# Altium schematic sheet Logic.SchDoc: Kookwekker
size A4; Author: Fabian Eppens; DrawnBy: Fabian Eppens; Revision: 1.0; SheetNumber: 2; SheetTotal: 3
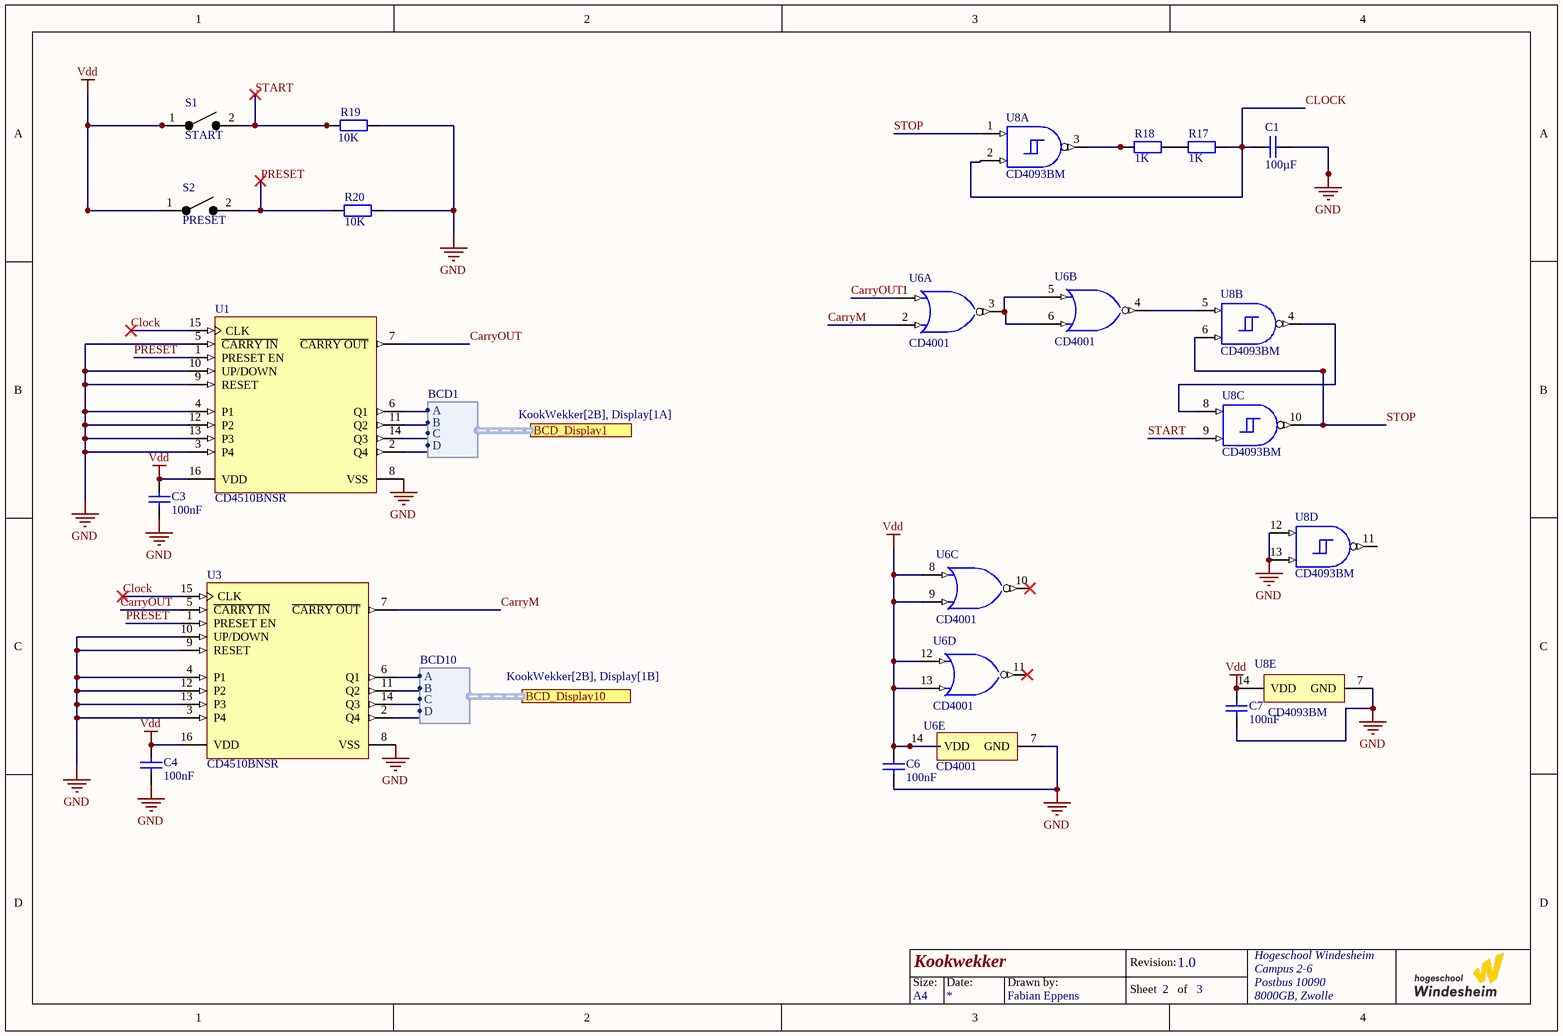
[diagram p0: Logic.SchDoc]

## Parts
C1  100µF  [C1206]
C3  100nF  [C1206]
C4  100nF  [C1206]
C6  100nF  [C1206]
C7  100nF  [C1206]
R17  1K  [R1206]
R18  1K  [R1206]
R19  10K  [R1206]
R20  10K  [R1206]
S1  START  [1478731]
S2  PRESET  [1478731]
U1  CD4510BNSR  [NS0016A_N]
U3  CD4510BNSR  [NS0016A_N]
U6  CD4001  [D0014A_N]  (parts A,B,C,D,E of 5)
U8  CD4093BM  [D0014A_N]  (parts A,B,C,D,E of 5)

## Ports
BCD_Display1 (harness BCD1, see KookWekker[2B], Display[1A]), BCD_Display10 (harness BCD10, see KookWekker[2B], Display[1B])

## Harnesses
BCD1: A, B, C, D
BCD10: A, B, C, D

## Nets
GND: C1.2 C3.2 C4.2 C6.1 C7.1 R19.2 R20.2 U1.3(P4) U1.4(P1) U1.5(~{CARRY_IN}) U1.8(VSS) U1.9(RESET) U1.10(UP/DOWN) U1.12(P2) U1.13(P3) U3.3(P4) U3.4(P1) U3.8(VSS) U3.9(RESET) U3.10(UP/DOWN) U3.12(P2) U3.13(P3) U6.7(GND) U8.7(GND) U8.12(G) U8.13(H)
Vdd: C3.1 C4.1 C6.2 C7.2 S1.1 S2.1 U1.16(VDD) U3.16(VDD) U6.8(E) U6.9(F) U6.12(G) U6.13(H) U6.14(VDD) U8.14(VDD)
CarryM: U3.7(~{CARRY_OUT}) U6.2(B)
CarryOUT: U1.7(~{CARRY_OUT}) U3.5(~{CARRY_IN}) U6.1(A)
Clock: C1.1 R17.2 U1.15(CLK) U3.15(CLK) U8.2(B)
PRESET: R20.1 S2.2 U1.1(PRESET_EN) U3.1(PRESET_EN)
START: R19.1 S1.2 U8.9(F)
STOP: U8.1(A) U8.6(D) U8.10(L)
NetR17_1: R17.1 R18.2
NetR18_1: R18.1 U8.3(J)
NetU1_2: U1.2(Q4) ; port BCD_Display1.D
NetU1_6: U1.6(Q1) ; port BCD_Display1.A
NetU1_11: U1.11(Q2) ; port BCD_Display1.B
NetU1_14: U1.14(Q3) ; port BCD_Display1.C
NetU3_2: U3.2(Q4) ; port BCD_Display10.D
NetU3_6: U3.6(Q1) ; port BCD_Display10.A
NetU3_11: U3.11(Q2) ; port BCD_Display10.B
NetU3_14: U3.14(Q3) ; port BCD_Display10.C
NetU6_3: U6.3(J) U6.5(C) U6.6(D)
NetU6_4: U6.4(K) U8.5(C)
NetU8_4: U8.4(K) U8.8(E)

Not connected (* = marked no-connect by the designer): U6 10(L)* 11(M)*; U8 11(M)

## Notes on the sheet
- Size:
- Date:
- Drawn by:
- Revision:
- Hogeschool Windesheim
- Campus 2-6
- Postbus 10090
- A4
- Sheet
- of
- 8000GB, Zwolle

## Library data of the parts
C1 C3 C4 C6 C7 = Capacitor_1206: SMD Capacitor 1206; Published: 03-11-2016; LatestRevisionDate: 03-11-2016; LatestRevisionNote: Creation; PackageReference: C1206; Publisher: Windesheim; PackageDescription: Chip Capacitor, Body 3.2x1.6mm, Height 1.7mm, IPC Medium Density
  C1: Value: 100µF
  C3 C4 C6 C7: Value: 100nF
R17-R20 = Resistor_1206: SMD Resistor 1206; Published: 03-11-2016; LatestRevisionDate: 03-11-2016; LatestRevisionNote: Creation; PackageReference: R1206; Publisher: Windesheim; PackageDescription: Chip Resistor, Body 3.2x1.6mm, IPC Medium Density
  R17 R18: Value: 1K
  R19 R20: Value: 10K
S1 S2 = Switch: Manufacturer_Name: TE Connectivity; Manufacturer_Part_Number: 147873-1; Datasheet Link: https://componentsearchengine.com/Datasheets/1/147873-1.pdf; Height: 5mm; Mouser Part Number: 506-147873-1; Mouser Price/Stock: https://www.mouser.com/Search/Refine.aspx?Keyword=506-147873-1
U1 U3 = CD4510BNSR: CMOS Presettable BCD Up/Down Counter, NS0016A, LARGE T&R; Manufacturer: Texas Instruments; Bits(#): 4; VCC(Min)(V): 3; Voltage(Nom)(V): 5,10,15; Schmitt Trigger: No; Output Drive (IOL/IOH)(Max)(mA): 1.5/-1.5; Rating: Catalog; Inputs: 1; VCC(Max)(V): 18; Technology Family: CD4000; F @ Nom Voltage(Max)(Mhz): 8; ICC @ Nom Voltage(Max)(mA): 0.03; tpd @ Nom Voltage(Max)(ns): 200; PackageReference: NS0016A; DatasheetVersion: SCHS071B; Generic Part Number: CD4510B; Operating Temperature Range(C): -55 to 125; Output Type: CMOS; Input Type: CMOS; Type: Other; Function: Counter
U6 = CD4001: CMOS Quad 2-Input NOR Schmitt Triggers, D0014A, TUBE; Generic Part Number: CD4093B; Manufacturer: Texas Instruments; Output Drive (IOL/IOH)(Max)(mA): 1.5/-1.5; VCC(Min)(V): 3; Rating: Catalog; Schmitt Trigger: Yes; Voltage(Nom)(V): 10; F @ Nom Voltage(Max)(Mhz): 8; ICC @ Nom Voltage(Max)(mA): 0.06; Bits(#): 4; VCC(Max)(V): 18; Technology Family: CD4000; DatasheetVersion: SCHS115D; Code_JEDEC: MS-012; Operating Temperature Range(C): -55 to 125; Output Type: CMOS; PackageReference: D0014A; Input Type: CMOS
U8 = CD4093BM: CMOS Quad 2-Input NAND Schmitt Triggers, D0014A, TUBE; Manufacturer: Texas Instruments; Output Drive (IOL/IOH)(Max)(mA): 1.5/-1.5; VCC(Min)(V): 3; Rating: Catalog; Schmitt Trigger: Yes; Voltage(Nom)(V): 10; F @ Nom Voltage(Max)(Mhz): 8; ICC @ Nom Voltage(Max)(mA): 0.06; Bits(#): 4; VCC(Max)(V): 18; Technology Family: CD4000; Generic Part Number: CD4093B; DatasheetVersion: SCHS115D; Code_JEDEC: MS-012; Operating Temperature Range(C): -55 to 125; Output Type: CMOS; PackageReference: D0014A; Input Type: CMOS